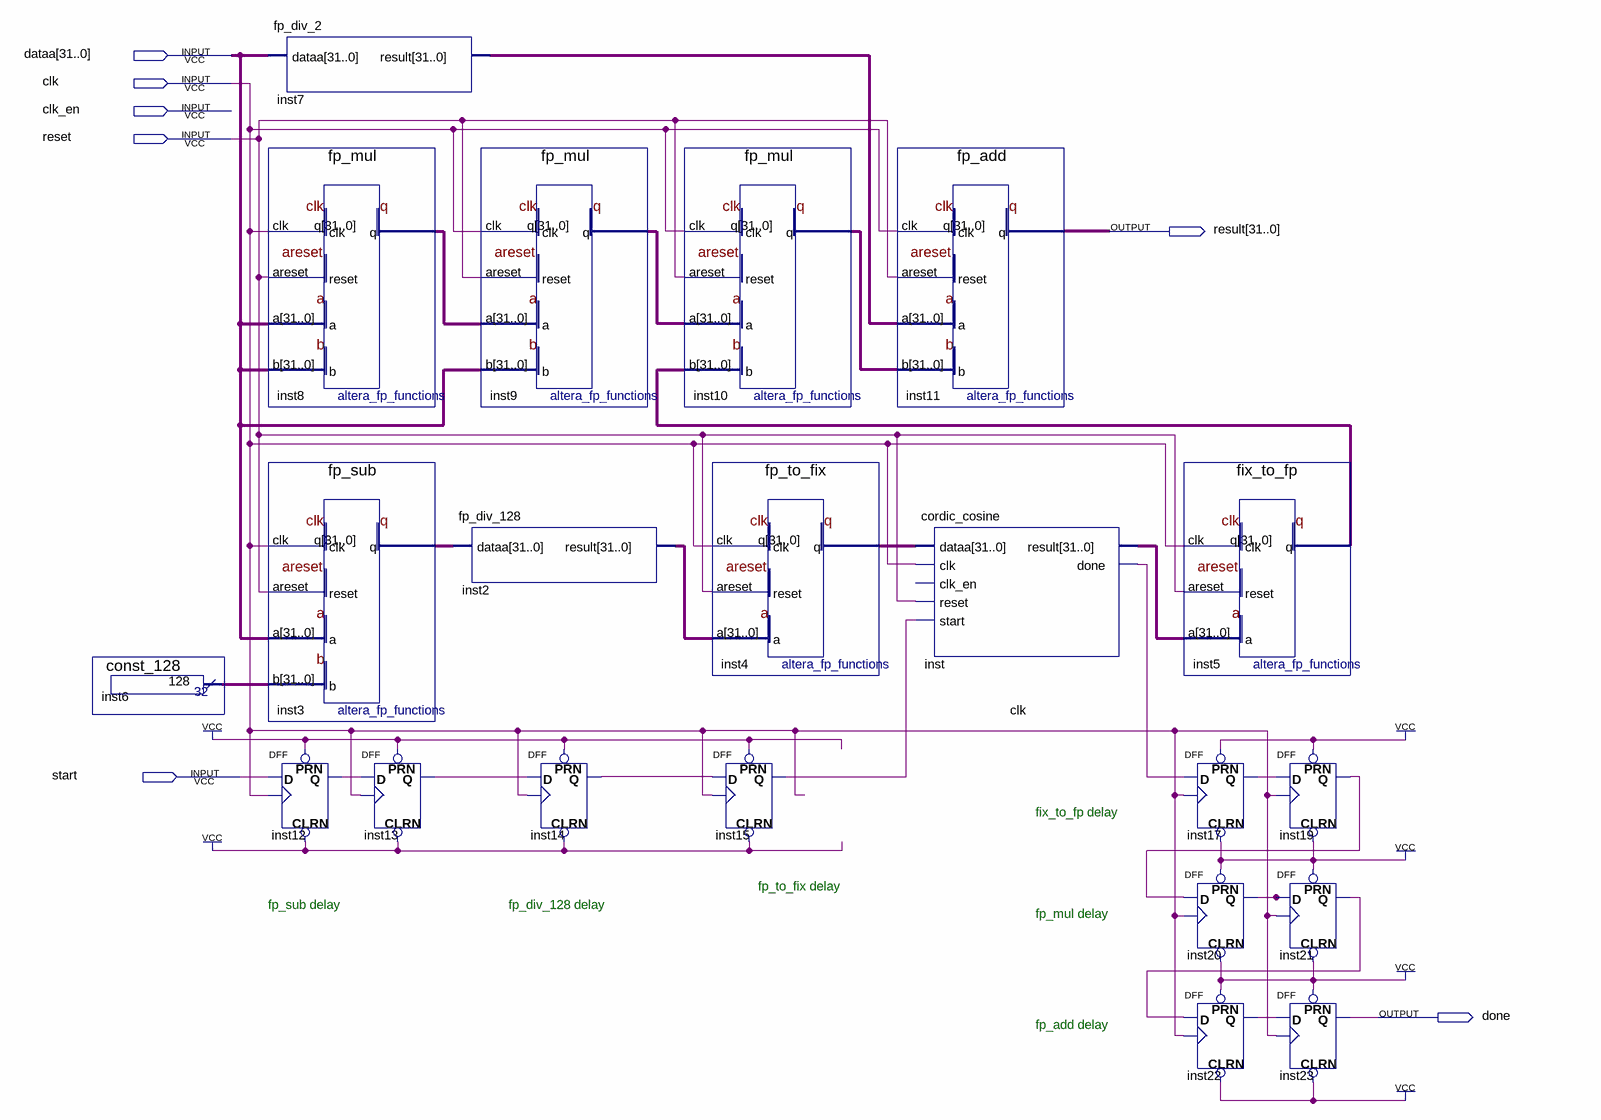
[diagram p0: schematic sheet]
// Quartus schematic inner_function.bdf as structural Verilog: 21 symbols, 7 pins
module inner_function (
  input  [31:0] dataa,
  input  clk,
  input  clk_en,
  input  reset,
  input  start,
  output [31:0] result,
  output done
);

  wire inst12_q, inst13_q, inst14_q, inst15_q, inst17_q, inst19_q, inst20_q, inst21_q, inst22_q, inst_done;
  wire [31:0] inst2_result, inst3_q, inst4_q, inst5_q, inst6_result, inst7_result, inst8_q, inst9_q,
       inst10_q, inst_result;

  const_128 inst6 (.result(inst6_result));
  fp_div_2 inst7 (.dataa(dataa), .result(inst7_result));
  fp_mul inst8 (.clk(clk), .areset(reset), .a(dataa), .b(dataa), .q(inst8_q));
  fp_sub inst3 (.clk(clk), .areset(reset), .a(dataa), .b(inst6_result), .q(inst3_q));
  DFF inst12 (.CLRN(1'b1), .CLK(clk), .D(start), .PRN(1'b1), .Q(inst12_q));
  DFF inst13 (.CLRN(1'b1), .CLK(clk), .D(inst12_q), .PRN(1'b1), .Q(inst13_q));
  fp_mul inst9 (.clk(clk), .areset(reset), .a(inst8_q), .b(dataa), .q(inst9_q));
  fp_div_128 inst2 (.dataa(inst3_q), .result(inst2_result));
  DFF inst14 (.CLRN(1'b1), .CLK(clk), .D(inst13_q), .PRN(1'b1), .Q(inst14_q));
  fp_mul inst10 (.clk(clk), .areset(reset), .a(inst9_q), .b(inst5_q), .q(inst10_q));
  fp_to_fix inst4 (.clk(clk), .areset(reset), .a(inst2_result), .q(inst4_q));
  DFF inst15 (.CLRN(1'b1), .CLK(clk), .D(inst14_q), .PRN(1'b1), .Q(inst15_q));
  fp_add inst11 (.clk(clk), .areset(reset), .a(inst7_result), .b(inst10_q), .q(result));
  cordic_cosine inst (
    .dataa(inst4_q), .clk(clk), .reset(reset), .start(inst15_q), .result(inst_result), .done(inst_done));  // open: clk_en
  fix_to_fp inst5 (.clk(clk), .areset(reset), .a(inst_result), .q(inst5_q));
  DFF inst17 (.CLRN(1'b1), .CLK(clk), .D(inst_done), .PRN(1'b1), .Q(inst17_q));
  DFF inst20 (.CLRN(1'b1), .CLK(clk), .D(inst19_q), .PRN(1'b1), .Q(inst20_q));
  DFF inst22 (.CLRN(1'b1), .CLK(clk), .D(inst21_q), .PRN(1'b1), .Q(inst22_q));
  DFF inst19 (.CLRN(1'b1), .CLK(clk), .D(inst17_q), .PRN(1'b1), .Q(inst19_q));
  DFF inst21 (.CLRN(1'b1), .CLK(clk), .D(inst20_q), .PRN(1'b1), .Q(inst21_q));
  DFF inst23 (.CLRN(1'b1), .CLK(clk), .D(inst22_q), .PRN(1'b1), .Q(done));

  // Notes on the sheet:
  //   fix_to_fp delay
  //   fp_to_fix delay
  //   fp_sub delay
  //   fp_div_128 delay
  //   fp_mul delay
  //   fp_add delay
endmodule
